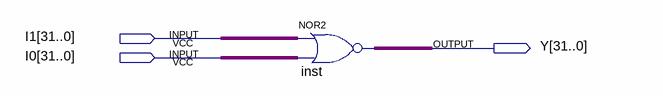
[diagram p0: schematic sheet]
// Quartus schematic NOR2-32bits.bdf as structural Verilog: 1 symbols, 3 pins
module \NOR2-32bits  (
  input  [31:0] I1,
  input  [31:0] I0,
  output [31:0] Y
);

  assign Y = ~(I1 | I0);  // NOR2 inst, 32 bits wide
endmodule
